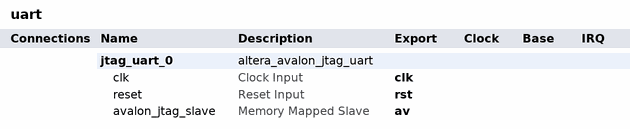
[diagram p0: system contents]
# Platform Designer (Qsys) system uart, Cyclone V 5CSEMA5F31C6
# Parameters at their usual value, and those the tool derives, are not listed.
package require -exact qsys 17.1
create_system uart
set_project_property DEVICE_FAMILY {Cyclone V}
set_project_property DEVICE 5CSEMA5F31C6

add_instance jtag_uart_0 altera_avalon_jtag_uart 17.1
set_instance_parameter_value jtag_uart_0 simInteractiveOptions NO_INTERACTIVE_WINDOWS

# exported interfaces
add_interface av avalon slave
set_interface_property av EXPORT_OF jtag_uart_0.avalon_jtag_slave
add_interface clk clock sink
set_interface_property clk EXPORT_OF jtag_uart_0.clk
add_interface rst reset sink
set_interface_property rst EXPORT_OF jtag_uart_0.reset

set_interconnect_requirement {$system} qsys_mm.clockCrossingAdapter HANDSHAKE
set_interconnect_requirement {$system} qsys_mm.enableEccProtection FALSE
set_interconnect_requirement {$system} qsys_mm.insertDefaultSlave FALSE
set_interconnect_requirement {$system} qsys_mm.maxAdditionalLatency 1

save_system uart.qsys
